# EAGLE design ECMeter-M0 (EAGLE 7.2.0)
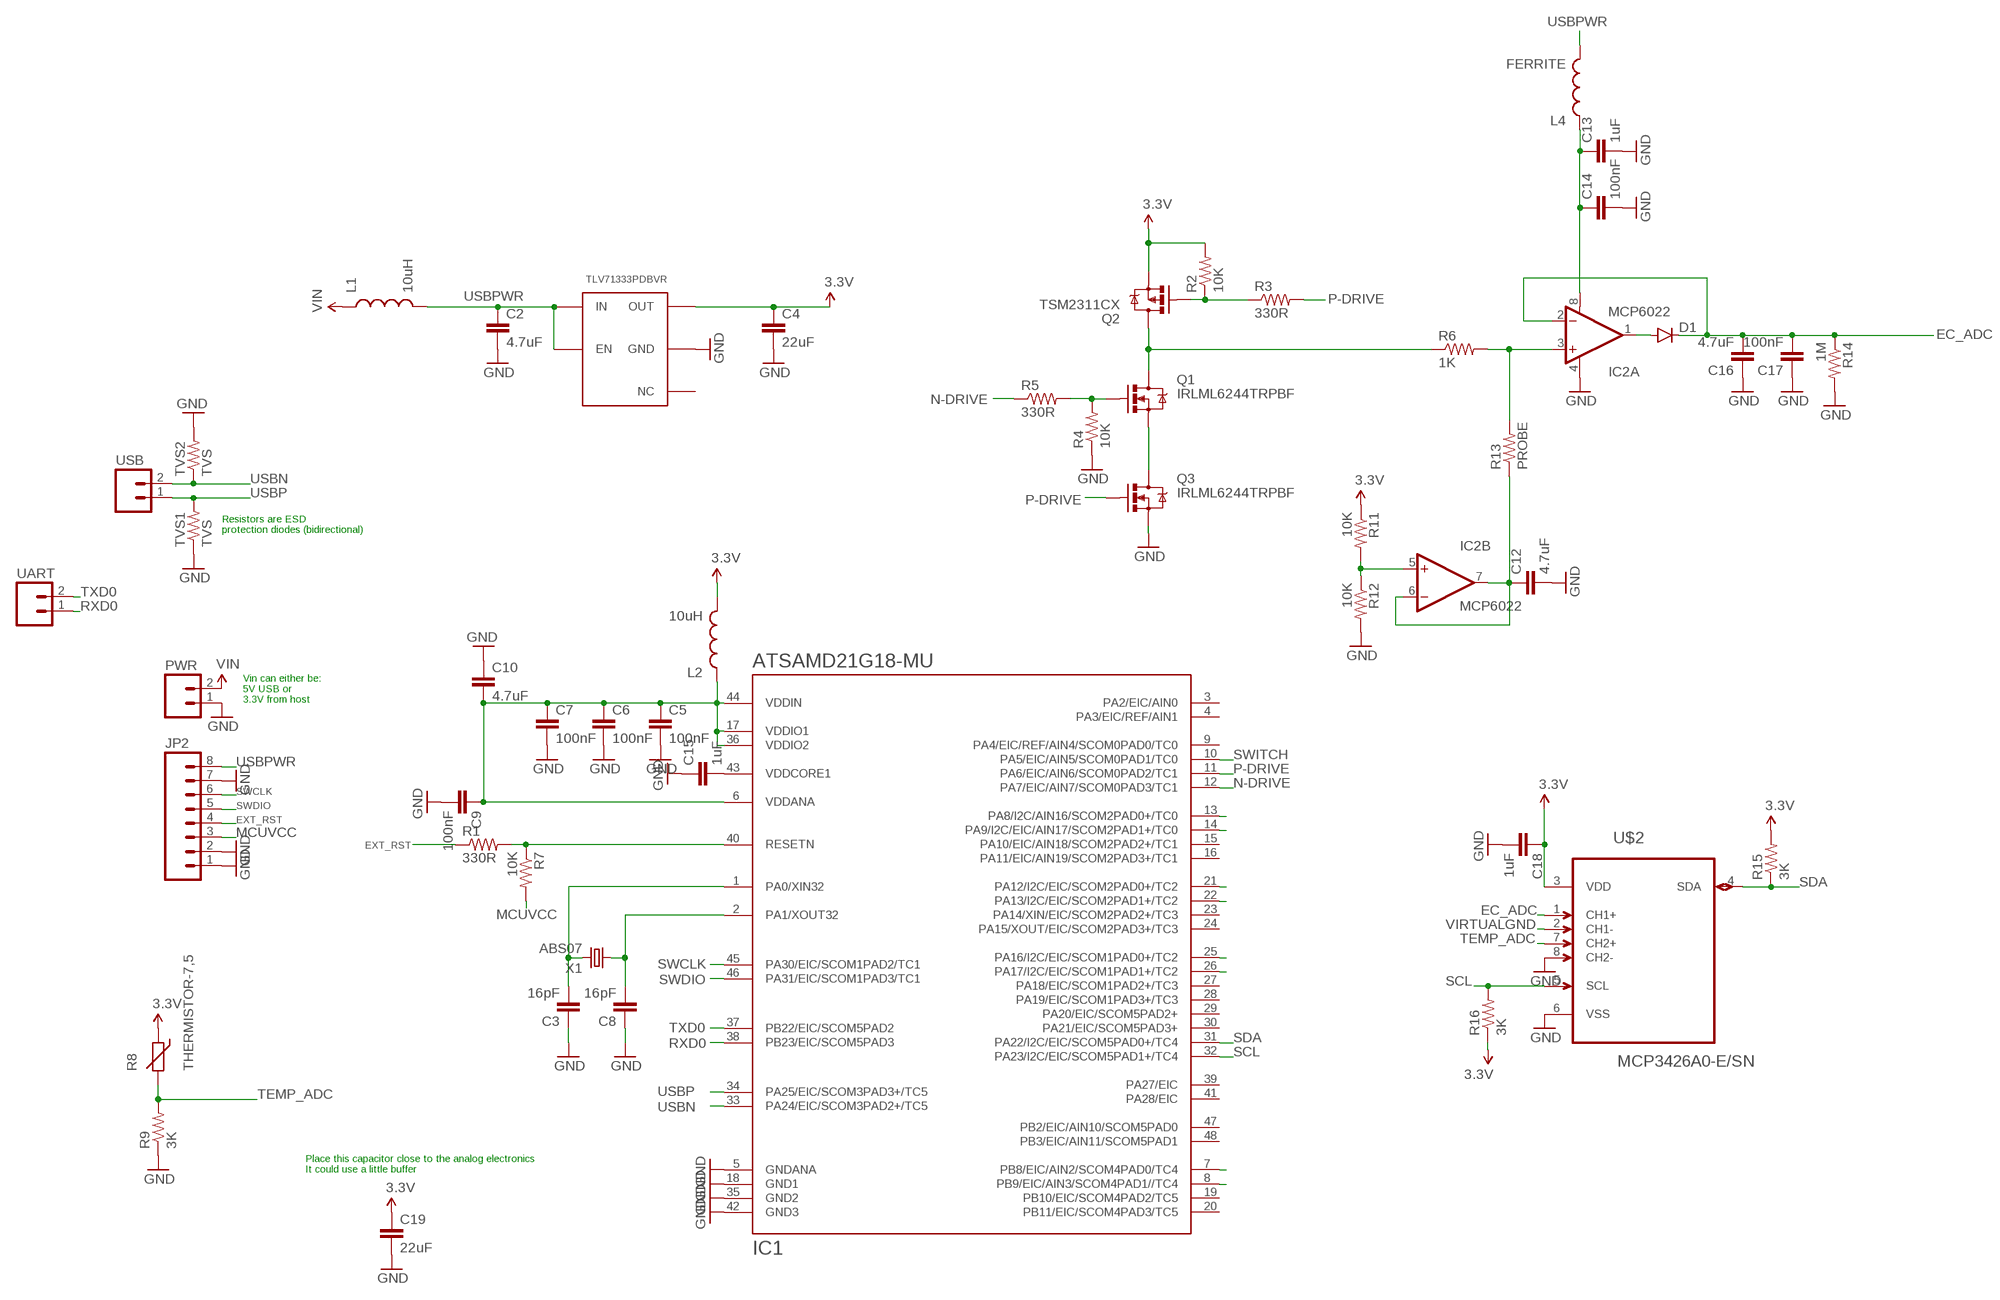
[diagram p0: schematic, sheet 1]

## Parts
C2  4.7uF  CAP0805  [0805]
C3  16pF  CAP0402-CAP  [0402-CAP]
C4  22uF  CAP0805  [0805]
C5  100nF  CAP0603-CAP  [0603-CAP]
C6  100nF  CAP0603-CAP  [0603-CAP]
C7  100nF  CAP0603-CAP  [0603-CAP]
C8  16pF  CAP0402-CAP  [0402-CAP]
C9  100nF  CAP0603-CAP  [0603-CAP]
C10  4.7uF  CAP0805  [0805]
C12  4.7uF  CAP0805  [0805]
C13  1uF  CAP0603-CAP  [0603-CAP]
C14  100nF  CAP0603-CAP  [0603-CAP]
C15  1uF  CAP0603-CAP  [0603-CAP]
C16  4.7uF  CAP0805  [0805]
C17  100nF  CAP0603-CAP  [0603-CAP]
C18  1uF  CAP0603-CAP  [0603-CAP]
C19  22uF  CAP0805  [0805]
D1  DIODESOD123  [SOD-123]
IC1  ATSAMD21G18-MU  [QFN48]
IC2  MCP6022  OPAMP-DUALU  [SO08]
JP2  M08NO_SILK_FEMALE_PTH  [1X08_NO_SILK]
L1  10uH  INDUCTOR0805  [0805]
L2  10uH  INDUCTOR0805  [0805]
L4  FERRITE  INDUCTOR0603  [0603]
PWR  M02LOCK_LONGPADS  [1X02_LOCK_LONGPADS]
Q1  IRLML6244TRPBF  MOSFET-NCHANNELAO3404A  [SOT23-3]
Q2  TSM2311CX  MOSFET-PCHANNEL  [SOT23-3]
Q3  IRLML6244TRPBF  MOSFET-NCHANNELAO3404A  [SOT23-3]
R1  330R  RESISTOR0603-RES  [0603-RES]
R2  10K  RESISTOR0603-RES  [0603-RES]
R3  330R  RESISTOR0603-RES  [0603-RES]
R4  10K  RESISTOR0603-RES  [0603-RES]
R5  330R  RESISTOR0603-RES  [0603-RES]
R6  1K  RESISTOR1206  [1206]
R7  10K  RESISTOR0603-RES  [0603-RES]
R8  THERMISTOR-7,5  [R-7,5]
R9  3K  RESISTOR0603-RES  [0603-RES]
R11  10K  RESISTOR0603-RES  [0603-RES]
R12  10K  RESISTOR0603-RES  [0603-RES]
R13  PROBE  RESISTORPTH-1W  [AXIAL-0.6]
R14  1M  RESISTOR0603-RES  [0603-RES]
R15  3K  RESISTOR0603-RES  [0603-RES]
R16  3K  RESISTOR0603-RES  [0603-RES]
TVS1  TVS  RESISTOR0603-RES  [0603-RES]
TVS2  TVS  RESISTOR0603-RES  [0603-RES]
U$1  TLV71333PDBVR  [TLV71333PDBVR]
U$2  MCP3426A0-E/SN  [SOIC127P600X175-8N]
UART  M02LOCK_LONGPADS  [1X02_LOCK_LONGPADS]
USB  M02LOCK_LONGPADS  [1X02_LOCK_LONGPADS]
X1  ABS07  [ABS07]

## Nets
3.3V: C4.1 C18.1 C19.1 L2.2 Q2.2(S) R2.2 R8.1 R11.1 R15.2 R16.1 U$1.P$5(OUT) U$2.3(VDD)
EC_ADC: C16.2 C17.2 D1.C IC2.2(A:-IN) R14.1 U$2.1(CH1+)
EXT_RST: JP2.4 R1.1
GND: C2.2 C3.1 C4.2 C5.2 C6.2 C7.2 C8.1 C9.2 C10.1 C12.2 C13.2 C14.2 C15.1 C16.1 C17.1 C18.2 C19.2 IC1.5(GNDANA) IC1.18(GND1) IC1.35(GND2) IC1.42(GND3) IC2.4(A:V-) JP2.1 JP2.2 JP2.7 PWR.1 Q3.2(S) R4.1 R9.1 R12.2 R14.2 TVS1.1 TVS2.2 U$1.P$2(GND) U$2.6(VSS) U$2.8(CH2-)
MCUVCC: C5.1 C6.1 C7.1 C9.1 C10.2 IC1.6(VDDANA) IC1.17(VDDIO1) IC1.36(VDDIO2) IC1.44(VDDIN) JP2.3 L2.1 R7.2
N$1: D1.A IC2.1(A:OUT)
N$2: IC1.40(RESETN) R1.2 R7.1
N$3: C3.2 IC1.1(PA0/XIN32) X1.P$2
N$4: IC1.13(PA8/I2C/AIN16/SCOM2PAD0+/TC0)
N$5: C8.2 IC1.2(PA1/XOUT32) X1.P$1
N$6: Q2.1(G) R2.1 R3.1
N$7: Q1.2(S) Q3.3(D)
N$8: Q1.3(D) Q2.3(D) R6.1
N$9: Q1.1(G) R4.2 R5.2
N$10: C15.2 IC1.43(VDDCORE1)
N$11: IC1.14(PA9/I2C/EIC/AIN17/SCOM2PAD1+/TC0)
N$12: IC1.21(PA12/I2C/EIC/SCOM2PAD0+/TC2)
N$13: IC2.3(A:+IN) R6.2 R13.P$2
N$14: IC2.5(B:+IN) R11.2 R12.1
N$15: IC1.22(PA13/I2C/EIC/SCOM2PAD1+/TC2)
N$16: C13.1 C14.1 IC2.8(A:V+) L4.1
N$17: IC1.25(PA16/I2C/EIC/SCOM1PAD0+/TC2)
N$18: IC1.26(PA17/I2C/EIC/SCOM1PAD1+/TC2)
N$19: IC1.7(PB8/EIC/AIN2/SCOM4PAD0/TC4)
N$20: IC1.8(PB9/EIC/AIN3/SCOM4PAD1//TC4)
N-DRIVE: IC1.12(PA7/EIC/AIN7/SCOM0PAD3/TC1) R5.1
P-DRIVE: IC1.11(PA6/EIC/AIN6/SCOM0PAD2/TC1) Q3.1(G) R3.2
RXD0: IC1.38(PB23/EIC/SCOM5PAD3) UART.1
SCL: IC1.32(PA23/I2C/EIC/SCOM5PAD1+/TC4) R16.2 U$2.5(SCL)
SDA: IC1.31(PA22/I2C/EIC/SCOM5PAD0+/TC4) R15.1 U$2.4(SDA)
SWCLK: IC1.45(PA30/EIC/SCOM1PAD2/TC1) JP2.6
SWDIO: IC1.46(PA31/EIC/SCOM1PAD3/TC1) JP2.5
SWITCH: IC1.10(PA5/EIC/AIN5/SCOM0PAD1/TC0)
TEMP_ADC: R8.2 R9.2 U$2.7(CH2+)
TXD0: IC1.37(PB22/EIC/SCOM5PAD2) UART.2
USBN: IC1.33(PA24/EIC/SCOM3PAD2+/TC5) TVS2.1 USB.2
USBP: IC1.34(PA25/EIC/SCOM3PAD3+/TC5) TVS1.2 USB.1
USBPWR: C2.1 JP2.8 L1.2 L4.2 U$1.P$1(IN) U$1.P$3(EN)
VIN: L1.1 PWR.2
VIRTUALGND: C12.1 IC2.6(B:-IN) IC2.7(B:OUT) R13.P$1 U$2.2(CH1-)
Unconnected: IC1.3(PA2/EIC/AIN0) IC1.4(PA3/EIC/REF/AIN1) IC1.9(PA4/EIC/REF/AIN4/SCOM0PAD0/TC0) IC1.15(PA10/EIC/AIN18/SCOM2PAD2+/TC1) IC1.16(PA11/EIC/AIN19/SCOM2PAD3+/TC1) IC1.19(PB10/EIC/SCOM4PAD2/TC5) IC1.20(PB11/EIC/SCOM4PAD3/TC5) IC1.23(PA14/XIN/EIC/SCOM2PAD2+/TC3) IC1.24(PA15/XOUT/EIC/SCOM2PAD3+/TC3) IC1.27(PA18/EIC/SCOM1PAD2+/TC3) IC1.28(PA19/EIC/SCOM1PAD3+/TC3) IC1.29(PA20/EIC/SCOM5PAD2+) IC1.30(PA21/EIC/SCOM5PAD3+) IC1.39(PA27/EIC) IC1.41(PA28/EIC) IC1.47(PB2/EIC/AIN10/SCOM5PAD0) IC1.48(PB3/EIC/AIN11/SCOM5PAD1) U$1.P$4(NC)

## Notes on the sheet
- Resistors are ESD
  protection diodes (bidirectional)
- Vin can either be:
  5V USB or
  3.3V from host
- Place this capacitor close to the analog electronics
  It could use a little buffer

## Library data of the parts
C2 C5-C7 C9 C13-C18 = SparkFun-Passives:CAP: Capacitor Standard 0603 ceramic capacitor, and 0.1" leaded capacitor.
C3 C4 C8 C10 C12 C19 = SparkFun-Capacitors:CAP: Capacitor Standard 0603 ceramic capacitor, and 0.1" leaded capacitor.
D1 = SparkFun-DiscreteSemi:DIODE: Diode These are standard reverse protection diodes and small signal diodes. SMA package can handle up to about 1A. SOD-323 can handle about 200mA. What the SOD-323 package when ordering, there are some mfgs out there that are 5-pin packages.
IC1 = gknff:ATSAMD21G18
IC2 = SparkFun-AnalogIC:OPAMP-DUAL: Generic op-amp footprint
JP2 = SparkFun-Connectors:M08: Header 8 Standard 8-pin 0.1" header. Use with straight break away headers (SKU : PRT-00116), right angle break away headers (PRT-00553), swiss pins (PRT-00743), machine pins (PRT-00117), and female headers (PRT-00115).; PROD_ID: CONN-08438
L1 L2 L4 = SparkFun-Passives:INDUCTOR: Inductors Basic Inductor/Choke - 0603 and 1206. Footprints are not proven and vary greatly between part numbers. INDUCTOR POWER 3.3UH 4.0A SMD 0.197" L x 0.197" W x 0.177" H (5.00mm x 5.00mm x 4.50mm)
PWR UART USB = SparkFun-Connectors:M02: Standard 2-pin 0.1" header. Use with - straight break away headers ( PRT-00116) - right angle break away headers (PRT-00553) - swiss pins (PRT-00743) - machine pins (PRT-00117) - female headers (PRT-00115) Molex polarized connector foot print use with: PRT-08233 with associated crimp pins and housings. 2.54_SCREWTERM for use with PRT-10571. 3.5mm Screw Terminal footprints for PRT-08084 5mm Screw Terminal footprints for use with PRT-08432
Q1 Q3 = SparkFun-DiscreteSemi:MOSFET-NCHANNEL: Common NMOSFET Parts MFG P/N Store ID Prod ID FDD8780 TRANS-09984 SI7820DN TRANS-11055 FDS6630A IC-08089 2N7002PW TRANS-11151 FQP30N06L COM-10213 TRANS-10060 BSS123LT1G TRANS-08345 BSS138 TRANS-00830 BS170 2N7000; PROD_ID: TRAN-12988
Q2 = SparkFun-DiscreteSemi:MOSFET-PCHANNEL: Generic PMOSFET IRLML2244 - TRANS-11153 (SOT-23 -20V -4.3A) (1.Gate 2.Source 3.Drain) FQP27P06 - COM-10349 <http://www.sparkfun.com/products/10349> (TO-220 -60V -27A) (1.Gate 2.Source 3.Drain); PROD_ID: TRANS-08285
R1-R7 R9 R11 R12 R14-R16 = SparkFun-Resistors:RESISTOR: Resistor Basic schematic elements and footprints for 0603, 1206, and PTH resistors.
R8 = varistor:THERMISTOR: THERMISTOR
R13 TVS1 TVS2 = SparkFun-Passives:RESISTOR: Resistor Basic schematic elements and footprints for 0603, 1206, and PTH resistors.
U$1 = m2m4all:TLV71333PDBVR
U$2 = m2m4all:MCP3426A0-E/SN: Analog-to-Digital Converter; MPN: MCP3426A0-E/SN; OC_FARNELL: 1825012; OC_NEWARK: 52R9954; PACKAGE: SOIC-8; SUPPLIER: Microchip
X1 = m2m4all:ABS07

## Board
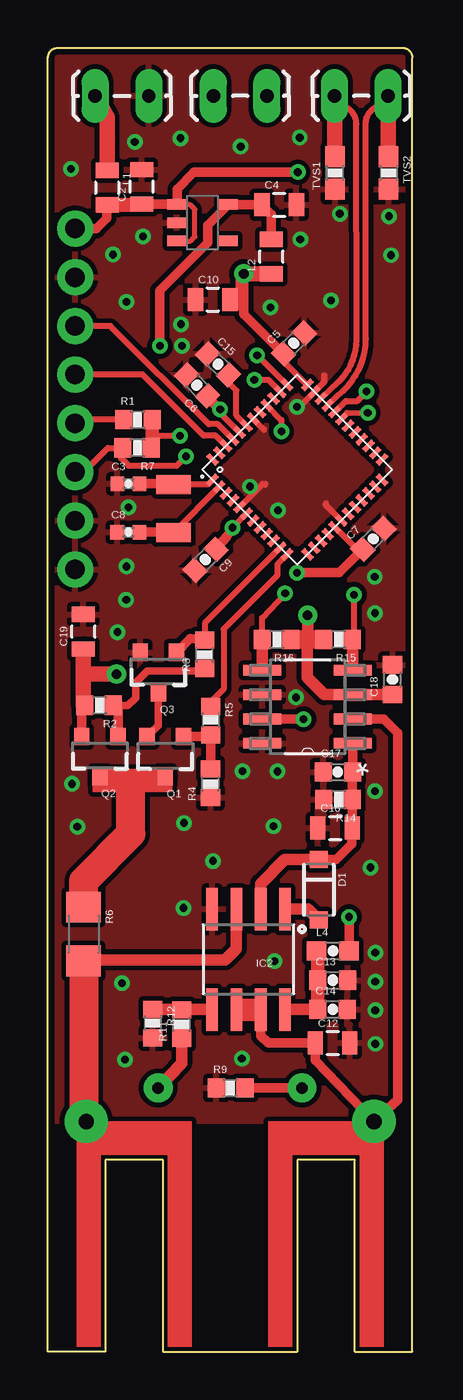
[diagram p1: board, top side]
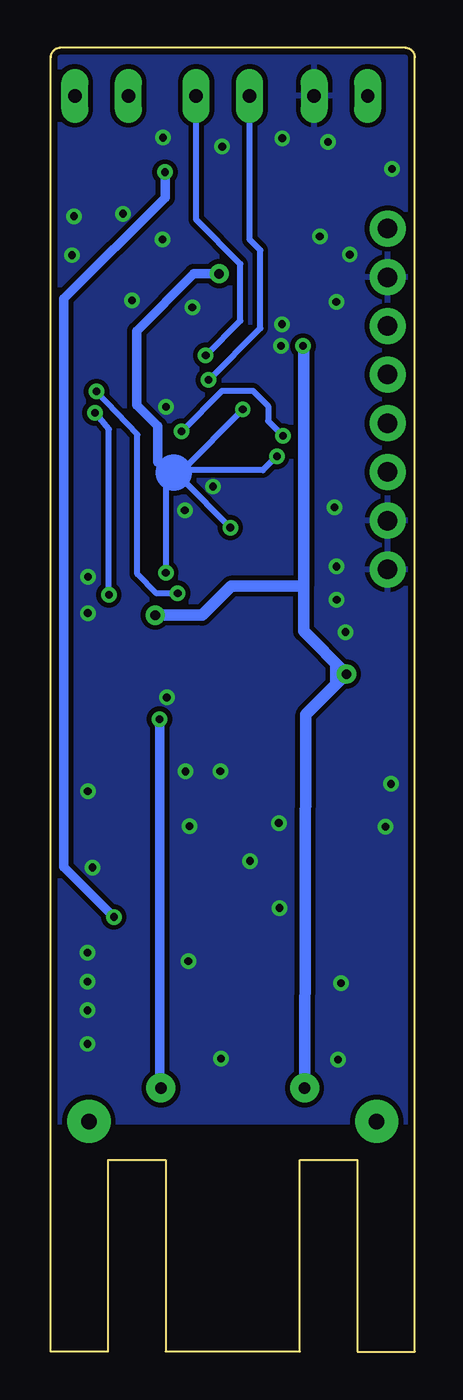
[diagram p2: board, bottom side, seen from below]

Size 19 x 68 mm. Coordinates in mm from the lower left corner, seen from the top.
Outline: 6,0 6,10 3,10 3,0 0,0 0,67.5 arc-90 0.5,68 18.5,68 arc-90 19,67.5 19,0 16,0 16,10 13,10 13,0 6,0
Copper layers (1*16): Top 0.035mm / dielectric 1.5mm / Bottom 0.035mm
Design rules "default *": minimum track width 10mil, minimum drill 24mil, track to track 10mil, track to pad 10mil, pad to pad 10mil, via to via 10mil, smd to smd 10mil, copper to edge 12mil, drill to drill 8mil, minimum pad ring 10mil, minimum via ring 8mil, stop-mask expansion 4mil, vias tented up to drill 20mil, thermal gap 10mil

### Footprints (pad centres in the part's own frame; a part is rotated, then mirrored left to right if it is on the bottom)
0805 = smd 0.8 x 1.2: 1 -0.9,0; 2 0.9,0
0402-CAP = smd 0.711 x 0.762: 1 -0.58,0; 2 0.58,0
0603-CAP = smd 0.889 x 1: 1 -0.774,0; 2 0.774,0
SOD-123 = smd 0.9 x 0.95: A 1.575,0; C -1.575,0
QFN48 = smd 0.3 x 0.7: 1 -2.75,-3.5; 2 -2.25,-3.5; 3 -1.75,-3.5; 4 -1.25,-3.5; 5 -0.75,-3.5; 6 -0.25,-3.5; 7 0.25,-3.5; 8 0.75,-3.5; 9 1.25,-3.5; 10 1.75,-3.5; 11 2.25,-3.5; 12 2.75,-3.5; 25 2.75,3.5; 26 2.25,3.5; 27 1.75,3.5; 28 1.25,3.5; 29 0.75,3.5; 30 0.25,3.5; 31 -0.25,3.5; 32 -0.75,3.5; 33 -1.25,3.5; 34 -1.75,3.5; 35 -2.25,3.5; 36 -2.75,3.5 | smd 0.7 x 0.3: 13 3.5,-2.75; 14 3.5,-2.25; 15 3.5,-1.75; 16 3.5,-1.25; 17 3.5,-0.75; 18 3.5,-0.25; 19 3.5,0.25; 20 3.5,0.75; 21 3.5,1.25; 22 3.5,1.75; 23 3.5,2.25; 24 3.5,2.75; 37 -3.5,2.75; 38 -3.5,2.25; 39 -3.5,1.75; 40 -3.5,1.25; 41 -3.5,0.75; 42 -3.5,0.25; 43 -3.5,-0.25; 44 -3.5,-0.75; 45 -3.5,-1.25; 46 -3.5,-1.75; 47 -3.5,-2.25; 48 -3.5,-2.75
SO08 = smd 0.61 x 2.21: 1 -1.905,-2.616; 2 -0.635,-2.616; 3 0.635,-2.616; 4 1.905,-2.616; 5 1.905,2.616; 6 0.635,2.616; 7 -0.635,2.616; 8 -1.905,2.616
1X08_NO_SILK = drill 1.016 pad 1.88: 1 0,0; 2 2.54,0; 3 5.08,0; 4 7.62,0; 5 10.16,0; 6 12.7,0; 7 15.24,0; 8 17.78,0
0603 = smd 1.016 x 1: 1 -0.85,0; 2 0.85,0
1X02_LOCK_LONGPADS = drill 0.7 pad 1.4 long: 1 -1.377,0; 2 1.417,0
SOT23-3 = smd 0.8 x 0.9: 1 -0.95,-1; 2 0.95,-1; 3 0,1.1
0603-RES = smd 0.889 x 1: 1 -0.711,0; 2 0.774,0
1206 = smd 1.6 x 1.8: 1 -1.4,0; 2 1.4,0
R-7,5 = drill 0.6 pad 1.5: 1 -3.75,0; 2 3.75,0
AXIAL-0.6 = drill 0.8 pad 2.25: P$1 -7.5,0; P$2 7.5,0
0603-RES' = smd 1.1 x 1: 1 -0.85,0; 2 0.85,0
TLV71333PDBVR = smd 0.55 x 1: P$1 -0.95,-1.35; P$2 0,-1.35; P$3 0.95,-1.35; P$4 0.95,1.35; P$5 -0.95,1.35
SOIC127P600X175-8N = smd 1.981 x 0.559: 1 -2.362,1.905; 2 -2.362,0.635; 3 -2.362,-0.635; 4 -2.362,-1.905; 5 2.362,-1.905; 6 2.362,-0.635; 7 2.362,0.635; 8 2.362,1.905
ABS07 = smd 1 x 1.8: P$1 1.25,0; P$2 -1.25,0

### Placement (x,y rotation side)
C2  4.89,60.75 90 top
C3  4.2,45.26 0 top
C4  12.06,59.82 0 top
C5  12.82,52.6 45 top
C6  7.76,50.4 135 top
C7  16.96,42.4 45 top
C8  4.19,42.74 0 top
C9  8.21,41.31 225 top
C10  8.6,54.88 0 top
C12  14.84,16.09 0 top
C13  14.85,19.37 0 top
C14  14.84,17.85 0 top
C15  8.87,51.5 315 top
C16  14.97,27.31 0 top
C17  15.12,30.23 0 top
C18  17.97,35.05 90 top
C19  1.85,37.55 90 top
D1  14.12,24.09 270 top
IC1  13,46 315 top
IC2  10.46,20.46 180 top
JP2  1.42,40.8 90 top
L1  3.08,60.71 270 top
L2  11.65,57.12 90 top
L4  14.86,20.9 0 top
PWR  3.88,65.5 180 top
Q1  6.12,31.08 180 top
Q2  2.71,31.09 180 top
Q3  5.76,35.47 180 top
R1  4.67,48.61 0 top
R2  2.7,33.71 180 top
R3  8.18,36.34 90 top
R4  8.48,29.61 90 top
R5  8.49,32.94 270 top
R6  1.86,21.78 270 top
R7  4.67,47.14 180 top
R8  9.5,13.75 0 top
R9  9.5,13.75 0 top
R11  6.97,17.06 90 top
R12  5.46,17.13 270 top
R13  9.5,12 180 top
R14  15.16,28.8 180 top
R15  15.16,37.15 180 top
R16  11.94,37.14 180 top
TVS1  TVS  [0603-RES']  14.97,61.48 90 top
TVS2  TVS  [0603-RES']  17.76,61.48 270 top
U$1  8.06,58.88 270 top
U$2  13.54,33.63 180 top
UART  10,65.5 0 top
USB  16.32,65.5 0 top
X1  6.54,43.98 270 top

### Tracks (layer width: path | path; a pad name or v marks a point on that pad's centre or on a via)
3.3V  (via drill 0.4 pad 0.8, 0.5 pad 1)
  Top 0.3: U$2.3 15.92,34.28 | R16.1 13.66,37.14 14.3,37.14 R15.2
  Top 0.5: 1.95,36.58 C19.1 | 13.54,37.26 13.66,37.14 | Q2.2 1.76,33.54 R2.2 | v5.84,52.45 5.84,55.35 8.33,57.84 8.33,58.75 U$1.P$5 C4.1 11.65,59.33 L2.2
  Top 0.6: 15.92,34.28 C18.1 | v13.54,38.41 13.54,37.26 | U$2.3 14.4,34.27 13.52,35.15 13.52,37 13.66,37.14 | R11.1 6.97,15.03 R8.1
  Top 0.8: R2.2 1.85,33.71 1.85,35.34 | 1.85,35.34 C19.1 | v3.57,35.34 1.85,35.34
  Bottom 0.6: 5.81,39.92 5.81,37.58 v3.57,35.34 5.69,33.22 R8.1 | 5.81,39.92 9.59,39.92 11.1,38.41 v13.54,38.41 | v5.84,52.45 5.81,52.42 5.81,39.92
EC_ADC
  Top 0.5: D1.C 15.04,25.66 15.84,26.47 15.84,27.28 C16.2 R14.1 15.87,30.21 C17.2 U$2.1
  Top 0.6: IC2.2 11.1,24.41 12.36,25.67 D1.C
EXT_RST
  Top 0.3: R1.1 1.61,48.61 JP2.4
GND  (via drill 0.4 pad 0.8)
  Top 0.3: IC1.5 11.2,45.26 11.35,45.26 11.31,45.22 11.18,45.22 | IC1.18 14.49,44.16 14.49,44.24 | IC1.35 14.41,50.59 14.41,50.92 14.4,50.91 14.4,50.57 13.12,49.29 | IC1.42 11.26,48.09
  other vias: 6.99,52.46 15.22,59.35 17.78,59.22 10.53,45.12 12,43.88 3.4,57.22 1.2,61.69 4.53,63.1 6.94,53.59 4.96,58.17 17.88,57.19 4.2,44.03 4.08,39.21 4.09,40.95 1.25,29.61 3.86,19.21 7.06,23.14 1.53,27.38 7.1,27.57 17.07,16.05 17.07,17.8 17.07,19.3 17.07,20.8 11.82,20.37 11.97,30.26 17.04,40.41 12.94,34.12 10.15,30.27 11.76,27.41 10.11,15.28 17.06,38.52 11.61,54.46 17.06,29.23 16.82,25.25 3.62,37.53 12.98,49.28 13.13,63.32 6.92,63.29 10.05,62.85 4.1,54.75 13.16,58.01 14.76,54.83 4.01,15.22 8.6,25.59
  pour Top: 0,12 0,68 19,68 19,12
  pour Bottom: 0,12 0,68 19,68 19,12
MCUVCC  (via drill 0.4 pad 0.8, 0.5 pad 1)
  Top 0.3: 8.98,49 v8.98,49.14 8.98,48.96 IC1.44 | C6.1 8.37,49.72 | IC1.36 12.27,51.68 C5.1 | IC1.6 9.69,43.04 v9.63,42.98 | v7.2,46.7 6.71,46.21 4.21,46.21 3.82,46.6 R7.2 3.89,47.13 3.12,47.13 1.87,45.88 JP2.3 | IC1.17 16.14,41.8 C7.1
  Top 0.406: C10.2 10.21,54.72 10.21,55
  Top 0.5: L2.1 11.26,56.27 v10.21,56.22 10.21,55 10.21,54.11 C5.1 | 8.37,49.72 v8.98,49.14 | v9.63,42.98 9.33,42.52 C9.1 | C7.1 15.2,40.63 v12.99,40.63
  Bottom 0.3: v8.98,49.14 12.11,45.97 | 12.11,45.97 13,45.97 13,45.93 12.57,45.5 | v7.2,46.7 7.93,45.97 12.11,45.97 | v9.63,42.98 12.14,45.5 12.57,45.5 | 12.57,45.5 12.99,45.08 v12.99,40.63
  Bottom 0.5: v10.21,56.22 11.53,56.22 14.51,53.24 14.51,49.37 13.42,48.28 13.42,46.39 13,45.97
N$1
  Top 0.6: IC2.1 13.56,23.08 D1.A
N$2  (via drill 0.4 pad 0.8)
  Top 0.3: IC1.40 12.17,48.6 v12.17,48 | R7.1 5.44,47.2 5.44,47.75 | 5.44,47.75 R1.2 | v6.88,47.76 5.45,47.76 5.44,47.75
  Bottom 0.3: v12.17,48 10.05,50.12 8.45,50.12 7.66,49.33 7.66,48.54 v6.88,47.76
N$3
  Top 0.3: IC1.1 8.34,45.23 X1.P$2 6.5,45.26
  Top 0.5: 6.5,45.26 C3.2
N$5
  Top 0.3: IC1.2 X1.P$1 6.52,42.74
  Top 0.5: 6.52,42.74 C8.2
N$6
  Top 0.4: R3.1 8.18,35.5 5.18,35.5 4.58,34.9 4.58,34.1 4.17,33.69 3.43,33.69 R2.1
  Top 0.5: Q2.1 3.66,33.71 R2.1
N$7
  Top 0.4: Q1.2 5.76,32.67 Q3.3
N$8
  Top 0.5: 4.33,29.3 4.33,29.82 4.5,29.99
  Top 0.8: Q2.3 4.5,29.99 Q1.3
  Top 1.5: R6.1 1.86,24.53 4.33,27 4.33,29.3
N$9
  Top 0.5: R4.2 R5.2 8.4,32.08 Q1.1
N$10
  Top 0.3: IC1.43 9.82,48.83 9.82,50.13 9.23,50.72 C15.2
N$13
  Top 0.6: IC2.3 9.82,21.02 9.25,20.44 1.92,20.44 R6.2
  Top 1.5: R6.2 1.86,12.02 R13.P$2
N$14
  Top 0.6: IC2.5 6.98,17.84 R11.2 R12.1
N$16
  Top 0.6: IC2.8 13.98,17.84 C14.1
  Top 0.7: L4.1 14.08,20.9 C13.1 14.07,19.37 C14.1
N-DRIVE
  Top 0.3: R5.1 8.49,33.89 9.16,34.56 9.16,37.68 11.96,40.48 11.96,41.07 IC1.12
P-DRIVE
  Top 0.3: IC1.11 8.18,38 R3.2
  Top 0.5: Q3.1 7.43,37.19 R3.2
RXD0  (via drill 0.4 pad 0.8)
  Top 0.3: IC1.38 11.5,50.68 v10.76,50.68
  Bottom 0.3: v10.76,50.68 8.06,53.38 8.06,57.44 8.62,58 UART.1
SCL  (via drill 0.4 pad 0.8)
  Top 0.3: 11.18,37.05 R16.2 11.17,38.27 v12.37,39.55 | IC1.32 15.53,49.59 16.14,49.59 16.53,49.98 v16.61,50.08
  Top 0.6: U$2.5 11.18,37.05
  Bottom 0.3: v12.37,39.55 13.48,39.55 14.48,40.55 14.48,47.82 v16.61,50.08
SDA  (via drill 0.4 pad 0.8)
  Top 0.3: 15.9,37.04 R15.1 15.96,37.15 v15.96,39.48 | IC1.31 15.61,48.96 v16.68,48.97
  Top 0.6: U$2.4 15.9,37.04
  Bottom 0.3: v15.96,39.48 15.96,48.11 v16.68,48.97
SWCLK
  Top 0.3: IC1.45 8.86,48.37 8.39,48.37 3.26,53.5 JP2.6
SWDIO
  Top 0.3: IC1.46 8.76,47.77 8.13,47.77 4.94,50.96 JP2.5
TEMP_ADC  (via drill 0.4 pad 0.8)
  Top 0.5: R9.2 R8.2 | U$2.7 v13.31,33 v13.32,32.99
  Bottom 0.5: v13.32,32.99 13.32,13.76 R8.2
TXD0  (via drill 0.4 pad 0.8)
  Top 0.3: IC1.37 10.93,51.96 v10.91,51.96
  Bottom 0.3: v10.91,51.96 9.1,53.77 9.1,56.73 11.42,59.05 UART.2
USBN
  Top 0.3: 17.51,65.01 USB.2 17.53,65.01 arc90 16.57,64.05 16.57,53.15 arc-51 15.4,50.12 IC1.33
  Top 0.8: TVS2.1 17.74,62.35 USB.2
USBP
  Top 0.3: IC1.34 15.15,50.58 arc47 16.09,52.78 16.08,64.03 arc90 15.1,65.01 USB.1
  Top 0.8: TVS1.2 14.94,62.36 USB.1
USBPWR  (via drill 0.4 pad 0.8)
  Top 0.25: U$1.P$3 7.44,57.93 7.66,58.15 7.66,59.58 7.42,59.82 U$1.P$1
  Top 0.5: U$1.P$1 6.74,59.84 | v15.7,22.67 L4.2 | U$1.P$1 6.69,59.85 C2.1 3.08,59.85 L1.2 3.07,59.13 2.52,58.58 JP2.8 | U$1.P$1 | v13.03,61.52 7.61,61.52 6.73,60.64 6.73,59.85 U$1.P$1
  Bottom 0.5: v15.7,22.67 18.3,25.27 18.3,54.92 13.03,60.19 v13.03,61.52
VIN
  Top 0.8: L1.1 3.08,64.38 PWR.2
VIRTUALGND
  Top 0.5: U$2.2 17.52,33 18.24,32.27 18.24,13.12 R13.P$1 13.94,15.18 C12.1 11.48,16.09 11.1,16.48 IC2.7
  Top 0.6: IC2.6 IC2.7
(copper drawn outside any net)
  shapes: Bottom area x1, Bottom circle x1, Top area x18